# Altium schematic sheet RK3588_FLASH_SD_EMMC.SchDoc
size 209 x 297 mm; SheetNumber: 5; SheetTotal: 23
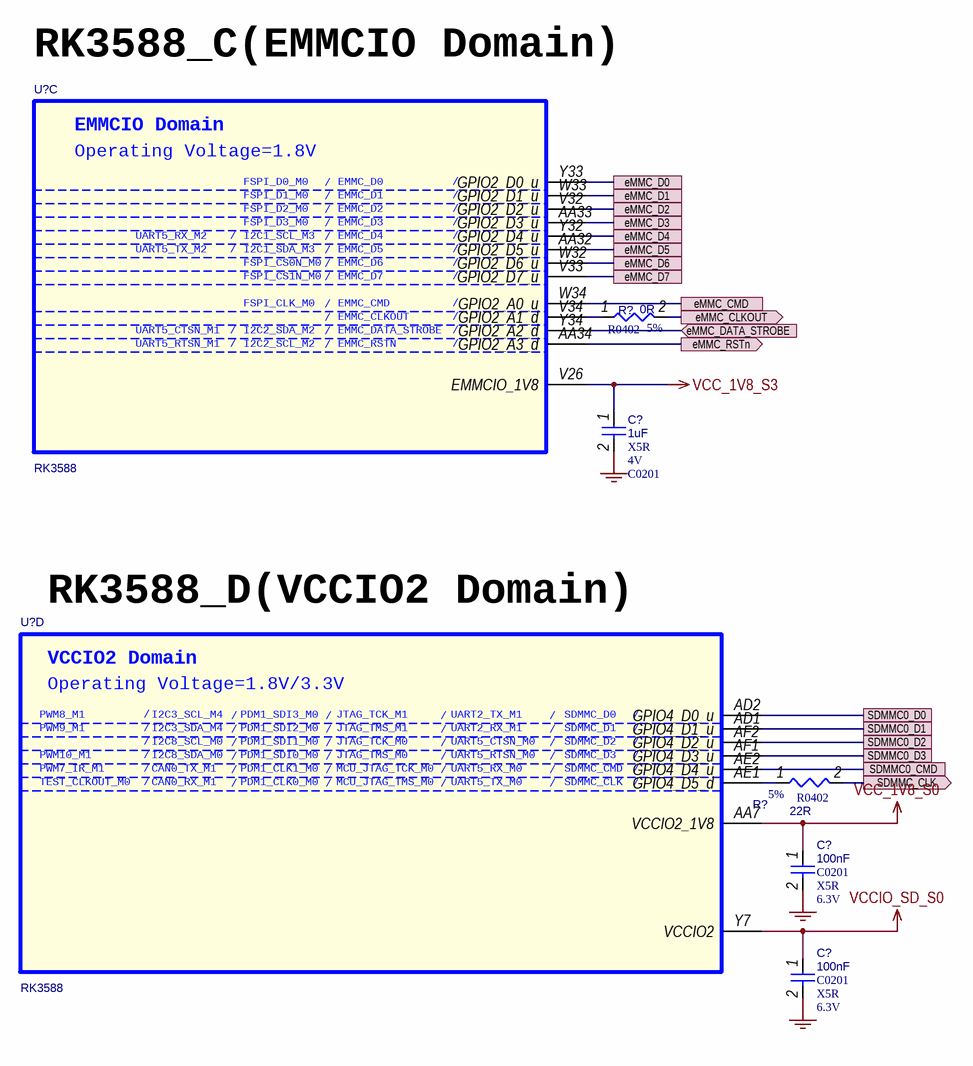
[diagram p0: RK3588_FLASH_SD_EMMC.SchDoc]

## Parts
(Parts that share a designator on the sheet are numbered #1, #2 ... from top to bottom, then left to right.)
C?#1  1uF  Dielectric: X5R  Voltage: 4V  [C0201]
C?#2  100nF  Dielectric: X5R  Voltage: 6.3V  [C0201]
C?#3  100nF  Dielectric: X5R  Voltage: 6.3V  [C0201]
R?#1  0R  Tolerance: 5%  [R0402]
R?#2  22R  Tolerance: 5%  [R0402]
U?#1  RK3588  [BGA1088_23R00X23R00X2R00]  (part C of 26)
U?#2  RK3588  [BGA1088_23R00X23R00X2R00]  (part D of 26)

## Ports
eMMC_CLKOUT (out, see FLASH_EMMC[1C]), eMMC_CMD (see FLASH_EMMC[1C]), eMMC_D0 (see FLASH_EMMC[2B]), eMMC_D1 (see FLASH_EMMC[2B]), eMMC_D2 (see FLASH_EMMC[2B]), eMMC_D3 (see FLASH_EMMC[2B]), eMMC_D4 (see FLASH_EMMC[2B]), eMMC_D5 (see FLASH_EMMC[2B]), eMMC_D6 (see FLASH_EMMC[2B]), eMMC_D7 (see FLASH_EMMC[2B]), eMMC_DATA_STROBE (in, see FLASH_EMMC[1C]), eMMC_RSTn (out, see FLASH_EMMC[1B]), SDMMC0_CMD (see FLASH_SD_CARD[2B]), SDMMC0_D0 (see FLASH_SD_CARD[2B]), SDMMC0_D1 (see FLASH_SD_CARD[2C]), SDMMC0_D2 (see FLASH_SD_CARD[2B]), SDMMC0_D3 (see FLASH_SD_CARD[2B]), SDMMC_CLK (out, see FLASH_SD_CARD[2B])

## Nets
GND: C?#1.2 C?#2.2 C?#3.2
VCC_1V8_S0: C?#2.1 U?#2.AA7(VCCIO2_1V8)
VCC_1V8_S3: C?#1.1 U?#1.V26(EMMCIO_1V8)
VCCIO_SD_S0: C?#3.1 U?#2.Y7(VCCIO2)
eMMC_CLKOUT: R?#1.2 ; port eMMC_CLKOUT
eMMC_CMD: U?#1.W34(GPIO2_A0_u) ; port eMMC_CMD
eMMC_D0: U?#1.Y33(GPIO2_D0_u) ; port eMMC_D0
eMMC_D1: U?#1.W33(GPIO2_D1_u) ; port eMMC_D1
eMMC_D2: U?#1.V32(GPIO2_D2_u) ; port eMMC_D2
eMMC_D3: U?#1.AA33(GPIO2_D3_u) ; port eMMC_D3
eMMC_D4: U?#1.Y32(GPIO2_D4_u) ; port eMMC_D4
eMMC_D5: U?#1.AA32(GPIO2_D5_u) ; port eMMC_D5
eMMC_D6: U?#1.W32(GPIO2_D6_u) ; port eMMC_D6
eMMC_D7: U?#1.V33(GPIO2_D7_u) ; port eMMC_D7
eMMC_DATA_STROBE: U?#1.Y34(GPIO2_A2_d) ; port eMMC_DATA_STROBE
eMMC_RSTn: U?#1.AA34(GPIO2_A3_d) ; port eMMC_RSTn
SDMMC0_CMD: U?#2.AE2(GPIO4_D4_u) ; port SDMMC0_CMD
SDMMC0_D0: U?#2.AD2(GPIO4_D0_u) ; port SDMMC0_D0
SDMMC0_D1: U?#2.AD1(GPIO4_D1_u) ; port SDMMC0_D1
SDMMC0_D2: U?#2.AF2(GPIO4_D2_u) ; port SDMMC0_D2
SDMMC0_D3: U?#2.AF1(GPIO4_D3_u) ; port SDMMC0_D3
SDMMC_CLK: R?#2.2 ; port SDMMC_CLK
NetR?#1_1: R?#1.1 U?#1.V34(GPIO2_A1_d)
NetR?#2_1: R?#2.1 U?#2.AE1(GPIO4_D5_d)

## Notes on the sheet
- RK3588_C(EMMCIO Domain)
- RK3588_D(VCCIO2 Domain)
- 297x210
- Формат А4
- (in symbol SOC_RK3588, part C) EMMCIO Domain; Operating Voltage=1.8V; FSPI_D0_M0; /; EMMC_D0; FSPI_D1_M0; EMMC_D1; FSPI_D2_M0; EMMC_D2; FSPI_D3_M0; EMMC_D3; UART5_RX_M2; I2C1_SCL_M3; EMMC_D4; UART5_TX_M2; I2C1_SDA_M3; EMMC_D5; FSPI_CS0N_M0; EMMC_D6; FSPI_CS1N_M0; EMMC_D7; FSPI_CLK_M0; EMMC_CMD; EMMC_CLKOUT; UART5_CTSN_M1; I2C2_SDA_M2; EMMC_DATA_STROBE; UART5_RTSN_M1; I2C2_SCL_M2; EMMC_RSTN
- (in symbol SOC_RK3588, part D) VCCIO2 Domain; Operating Voltage=1.8V/3.3V; PWM8_M1; /; I2C3_SCL_M4; PDM1_SDI3_M0; JTAG_TCK_M1; UART2_TX_M1; SDMMC_D0; PWM9_M1; I2C3_SDA_M4; PDM1_SDI2_M0; JTAG_TMS_M1; UART2_RX_M1; SDMMC_D1; I2C8_SCL_M0; PDM1_SDI1_M0; JTAG_TCK_M0; UART5_CTSN_M0; SDMMC_D2; PWM10_M1; I2C8_SDA_M0; PDM1_SDI0_M0; JTAG_TMS_M0; UART5_RTSN_M0; SDMMC_D3; PWM7_IR_M1; CAN0_TX_M1; PDM1_CLK1_M0; MCU_JTAG_TCK_M0; UART5_RX_M0; SDMMC_CMD; TEST_CLKOUT_M0; CAN0_RX_M1; PDM1_CLK0_M0; MCU_JTAG_TMS_M0; UART5_TX_M0; SDMMC_CLK

## Library data of the parts
C?#1 = CAP NP_Dup1: cap,1.00uF,+/-20%,4V,X5R,C0201; Part Reference: C1300; Manufacturer: TDK; RK PN: C0603X5R0G105M030BC; Priority: A; Tolerance: 20%; PCB Footprint: C0201; Value: 1uF; Part Type: C0201; Manufacturer PN: C0603X5R0G105M030BC; Created by: JJJ
C?#2 = CAP NP_Dup1: cap,100.00nF,+/-10%,6.3V,X5R,C0201; Part Reference: C1301; Manufacturer: TDK; RK PN: C0603X5R0J104K030BC; Priority: A; Tolerance: 10%; PCB Footprint: C0201; Value: 100nF; Part Type: C0201; Manufacturer PN: C0603X5R0J104K030BC; Created by: JJJ
C?#3 = CAP NP_Dup1: cap,100.00nF,+/-10%,6.3V,X5R,C0201; Part Reference: C1302; Manufacturer PN: C0603X5R0J104K030BC; Manufacturer: TDK; Tolerance: 10%; Priority: A; PCB Footprint: C0201; Value: 100nF; Created by: JJJ; Part Type: C0201; RK PN: C0603X5R0J104K030BC
R?#1 = RESISTOR_Dup2: НЁУГєсД¤µзЧи,0R,+/-5%,R0402,1/16W.; Part Reference: R1317; Manufacturer: YAGEO; RK PN: RC0402JR-070RL; Priority: A; Wattage: 1/16W; PCB Footprint: R0402; Value: 0R; Part Type: НЁУГєсД¤µзЧи; Manufacturer PN: RC0402JR-070RL; Created by: YTL
R?#2 = RESISTOR_Dup2: НЁУГєсД¤µзЧи,22R,+/-5%,R0402,1/16W.; Part Reference: R1320; Manufacturer PN: RC0402JR-0722RL; Manufacturer: YAGEO; Wattage: 1/16W; Priority: A; PCB Footprint: R0402; Value: 22R; Created by: YTL; Part Type: НЁУГєсД¤µзЧи; RK PN: RC0402JR-0722RL
U?#1 U?#2 = SOC_RK3588: ROCKCHIP SOC; Part Reference: U1000; Manufacturer: Rockchip (ИрРѕОў); SWAP_INFO: (S1+S2+S3+S4+S5+S6+S7+S8+S9+S10+S11+S12+S13+S14+S15+S16+S17+S18+S19+S20+S21+S22+S23+S24+S25+S26); SPLIT_INST: TRUE; Priority: A; Value: RK3588; PCB Footprint: BGA1088_23R00X23R00X2R00; Created by: YWQ; Manufacturer PN: RK3588; Part Type: SOC; RK PN: RK3588